# EAGLE design INA260-Evaluation (EAGLE 9.1.3)
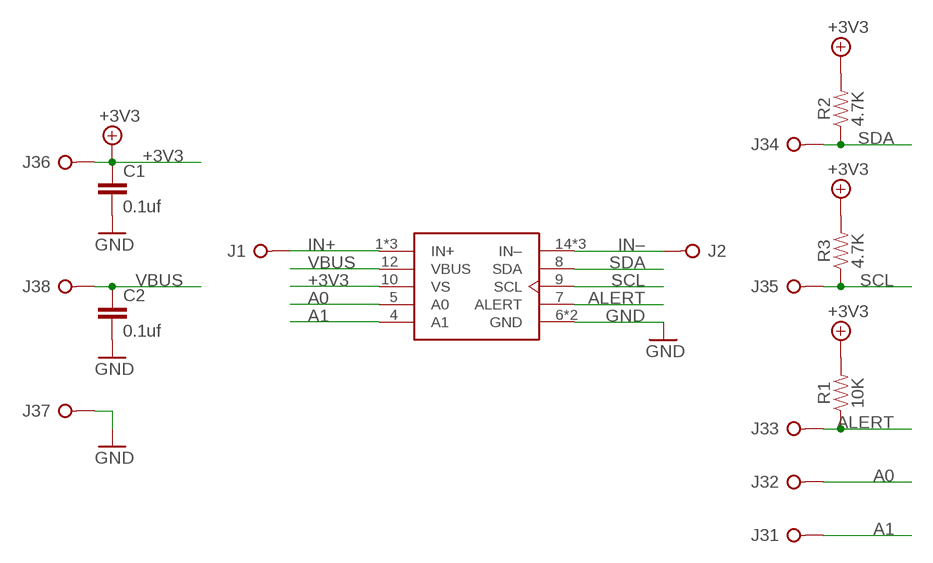
[diagram p0: schematic, sheet 1]

## Parts
C1  0.1uf  CAPACITOR-0805  [CAPACITOR-0805]
C2  0.1uf  CAPACITOR-0805  [CAPACITOR-0805]
IC1  INA260  [TSSOP-16]
J1  PINHD-1X1BIG  [1X01-BIG]
J2  PINHD-1X1BIG  [1X01-BIG]
J3  PINHD-1X8  [1X08]
R1  10K  RESISTOR-0805  [RESISTOR-0805]
R2  4.7K  RESISTOR-0805  [RESISTOR-0805]
R3  4.7K  RESISTOR-0805  [RESISTOR-0805]

## Nets
+3V3: C1.1 IC1.10(VS) J3.6 R1.2 R2.2 R3.2
A0: IC1.5(A0) J3.2
A1: IC1.4(A1) J3.1
ALERT: IC1.7(ALERT) J3.3 R1.1
GND: C1.2 C2.2 IC1.6(GND) IC1.11(GND) J3.7
IN+: IC1.1(IN+) IC1.2(IN+) IC1.3(IN+) J1.1(KL)
IN–: IC1.14(IN–) IC1.15(IN–) IC1.16(IN–) J2.1(KL)
SCL: IC1.9(SCL) J3.5 R3.1
SDA: IC1.8(SDA) J3.4 R2.1
VBUS: C2.1 IC1.12(VBUS) J3.8

## Library data of the parts
C1 C2 = SaintGimp:CAPACITOR: Ceramic Capacitor
IC1 = SaintGimp:INA260: Digital Current and Power Monitor With Integrated Shunt
J1 J2 = SaintGimp:PINHD-1X1
J3 = SaintGimp:PINHD-1X8
R1-R3 = SaintGimp:RESISTOR-*

## Board
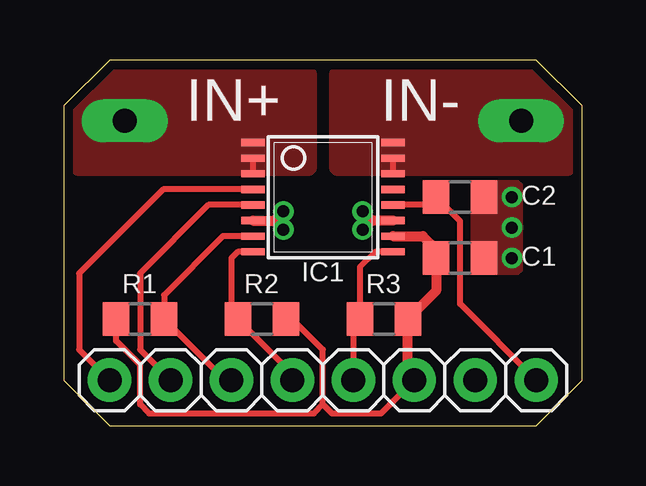
[diagram p1: board, top side]
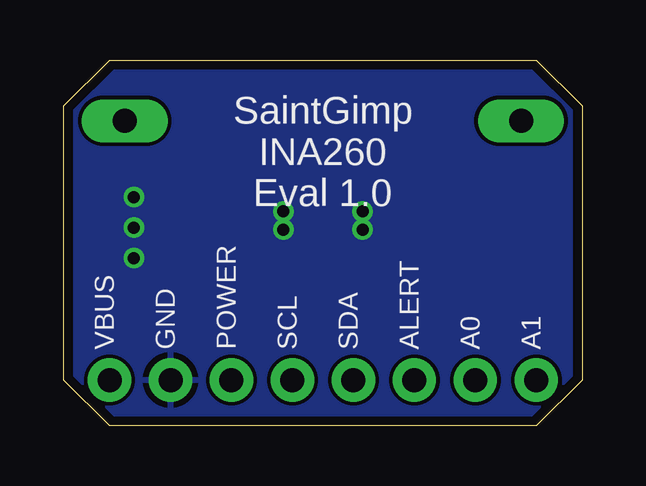
[diagram p2: board, bottom side, seen from below]

Size 21.59 x 15.24 mm. Coordinates in mm from the lower left corner, seen from the top.
Outline: 0,13.34 0,1.91 1.91,0 19.68,0 21.59,1.91 21.59,13.34 19.68,15.24 1.91,15.24 0,13.34
Copper layers (1*16): Top 0.0356mm / dielectric 1.5011mm / Bottom 0.0356mm
Design rules "Saintgimp-OSHPark": minimum track width 10mil, minimum drill 13mil, track to track 6mil, track to pad 6mil, pad to pad 6mil, via to via 6mil, smd to smd 6mil, copper to edge 15mil, drill to drill 6mil, minimum pad ring 12mil, minimum via ring 7mil, stop-mask expansion 2mil, vias tented up to drill 24mil, thermal gap 10mil

### Footprints (pad centres in the part's own frame; a part is rotated, then mirrored left to right if it is on the bottom)
CAPACITOR-0805 = smd 1.1 x 1.4: 1 -1,0; 2 1,0
TSSOP-16 = smd 0.305 x 0.991: 1 -2.275,-2.918; 2 -1.625,-2.918; 3 -0.975,-2.918; 4 -0.325,-2.918; 5 0.325,-2.918; 6 0.975,-2.918; 7 1.625,-2.918; 8 2.275,-2.918; 9 2.275,2.918; 10 1.625,2.918; 11 0.975,2.918; 12 0.325,2.918; 13 -0.325,2.918; 14 -0.975,2.918; 15 -1.625,2.918; 16 -2.275,2.918
1X01-BIG = drill 1 long: 1 0,0
1X08 = drill 1: 1 -8.89,0; 2 -6.35,0; 3 -3.81,0; 4 -1.27,0; 5 1.27,0; 6 3.81,0; 7 6.35,0; 8 8.89,0
RESISTOR-0805 = smd 1.1 x 1.4: 1 -1,0; 2 1,0

### Placement (x,y rotation side)
C1  16.51,6.99 0 top
C2  16.51,9.53 0 top
IC1  10.79,9.53 270 top
J1  2.54,12.7 90 top
J2  19.05,12.7 90 top
J3  10.79,1.91 0 top
R1  3.17,4.45 180 top
R2  8.26,4.45 0 top
R3  13.34,4.45 0 top

### Tracks (layer width: path | path; a pad name or v marks a point on that pad's centre or on a via)
+3V3
  Top 0.254: 14.34,4.17 R3.2 | 10.79,0.89 11.18,0.51 13.21,0.51 J3.6 | 10.79,0.89 10.79,3.17 9.53,4.45 R2.2 | 10.79,0.89 10.41,0.51 3.56,0.51 3.17,0.89 3.17,2.54 2.17,3.54 R1.2
  Top 0.406: IC1.10 14.96,7.9 15.51,7.35 C1.1 15.51,5.62 R3.2 | J3.6 14.34,2.17 14.34,4.17
A0
  Top 0.254: IC1.5 6.03,9.2 3.17,6.35 3.17,3.17 J3.2
A1
  Top 0.254: IC1.4 4.13,9.85 0.64,6.35 0.64,3.17 J3.1
ALERT
  Top 0.254: IC1.7 6.63,7.9 4.17,5.45 R1.1 6.71,1.91 J3.3
GND  (via drill 0.5)
  Top 0.406: IC1.11 12.83,8.55 | 12.83,8.55 v12.45,8.93 v12.45,8.17 12.83,8.55 | IC1.6 8.76,8.55 | 8.76,8.55 v9.14,8.93 v9.14,8.17 8.76,8.55
  other vias: 18.67,8.26 18.67,9.53 18.67,6.99
  pour Bottom: 0,0 0,15.24 21.59,15.24 21.59,0
  pour Top (no thermals): 17.02,10.16 18.92,10.16 19.05,10.03 19.05,6.48 18.92,6.35 17.02,6.35
IN+
  Top 0.254: IC1.2 IC1.3
  pour Top (no thermals): 10.16,10.79 0.64,10.79 0.64,14.61 10.16,14.61
IN–
  Top 0.254: IC1.15 IC1.14
  pour Top (no thermals): 11.43,10.79 20.95,10.79 20.95,14.61 11.43,14.61
SCL
  Top 0.254: J3.5 12.06,4.17 R3.1 12.34,6.62 12.96,7.25 IC1.9
SDA
  Top 0.254: J3.4 9.53,2.17 R2.1 6.99,4.71 6.99,6.99 7.25,7.25 IC1.8
VBUS
  Top 0.254: IC1.12 15.19,9.2 C2.1 16.51,8.53 16.51,5.08 J3.8

### Text on the board
tPlace: IN+ | IN-
bPlace: SaintGimp / INA260 / Eval 1.0 | A1 | A0 | ALERT | SDA | SCL | POWER | GND | VBUS